# Altium project chinook_pcb_rotor.PrjPcb (part 2 of 2)

## Sheet led.SchDoc
size A4; SheetNumber: 9; SheetTotal: 12
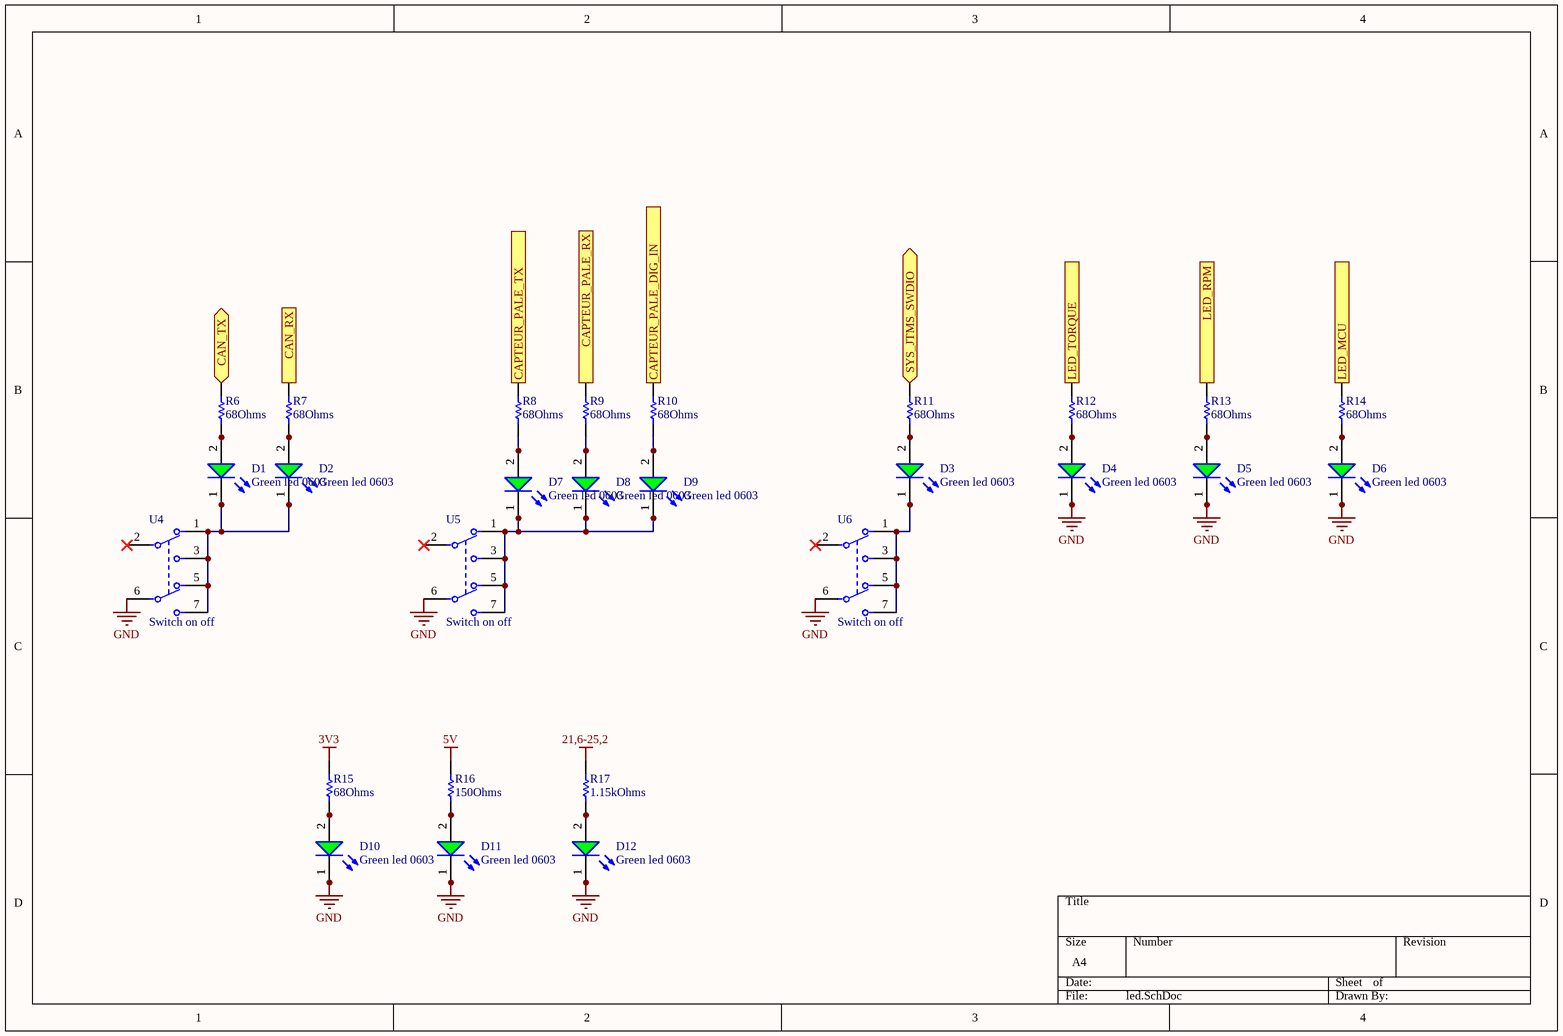
[diagram p8: led.SchDoc]

### Parts
(Parts that share a designator on the sheet are numbered #1, #2 ... from top to bottom, then left to right.)
D1#1  Green led 0603  [WL-SMCW_0603_150060xx75000]
D2  Green led 0603  [WL-SMCW_0603_150060xx75000]
D3  Green led 0603  [WL-SMCW_0603_150060xx75000]
D4  Green led 0603  [WL-SMCW_0603_150060xx75000]
D5  Green led 0603  [WL-SMCW_0603_150060xx75000]
D6  Green led 0603  [WL-SMCW_0603_150060xx75000]
D7  Green led 0603  [WL-SMCW_0603_150060xx75000]
D8  Green led 0603  [WL-SMCW_0603_150060xx75000]
D9  Green led 0603  [WL-SMCW_0603_150060xx75000]
D10  Green led 0603  [WL-SMCW_0603_150060xx75000]
D11  Green led 0603  [WL-SMCW_0603_150060xx75000]
D12  Green led 0603  [WL-SMCW_0603_150060xx75000]
R6#1  68Ohms  [RESC1005X40X25LL05T10]
R7#1  68Ohms  [RESC1005X40X25LL05T10]
R8#1  68Ohms  [RESC1005X40X25LL05T10]
R9#1  68Ohms  [RESC1005X40X25LL05T10]
R10#1  68Ohms  [RESC1005X40X25LL05T10]
R11#1  68Ohms  [RESC1005X40X25LL05T10]
R12#1  68Ohms  [RESC1005X40X25LL05T10]
R13  68Ohms  [RESC1005X40X25LL05T10]
R14  68Ohms  [RESC1005X40X25LL05T10]
R15  68Ohms  [RESC1005X40X25LL05T10]
R16  150Ohms  [RESC1005X40X25LL05T10]
R17  1.15kOhms  [RESC1005X40X25NL05T10]
U4#1  Switch on off  [FP-JS202011JCQN-MFG]
U5#1  Switch on off  [FP-JS202011JCQN-MFG]
U6#2  Switch on off  [FP-JS202011JCQN-MFG]

### Ports
CAN_RX, CAN_TX (bidir), CAPTEUR_PALE_DIG_IN (out), CAPTEUR_PALE_RX, CAPTEUR_PALE_TX (out), LED_MCU (out), LED_RPM (out), LED_TORQUE (out), SYS_JTMS_SWDIO (bidir)

### Nets
3V3: R15.2
5V: R16.2
21,6-25,2: R17.2
GND: D4.1(K) D5.1(K) D6.1(K) D10.1(K) D11.1(K) D12.1(K) U4#1.6(2_C) U5#1.6(2_C) U6#2.6(2_C)
SYS_JTMS_SWDIO: R11#1.2 ; port SYS_JTMS_SWDIO
NetD1#1_1: D1#1.1(K) D2.1(K) U4#1.1 U4#1.3 U4#1.5 U4#1.7
NetD1#1_2: D1#1.2(A) R6#1.1
NetD2_2: D2.2(A) R7#1.1
NetD3_1: D3.1(K) U6#2.1 U6#2.3 U6#2.5 U6#2.7
NetD3_2: D3.2(A) R11#1.1
NetD4_2: D4.2(A) R12#1.1
NetD5_2: D5.2(A) R13.1
NetD6_2: D6.2(A) R14.1
NetD7_1: D7.1(K) D8.1(K) D9.1(K) U5#1.1 U5#1.3 U5#1.5 U5#1.7
NetD7_2: D7.2(A) R8#1.1
NetD8_2: D8.2(A) R9#1.1
NetD9_2: D9.2(A) R10#1.1
NetD10_2: D10.2(A) R15.1
NetD11_2: D11.2(A) R16.1
NetD12_2: D12.2(A) R17.1
NetR6#1_2: R6#1.2 ; port CAN_TX
NetR7#1_2: R7#1.2 ; port CAN_RX
NetR8#1_2: R8#1.2 ; port CAPTEUR_PALE_TX
NetR9#1_2: R9#1.2 ; port CAPTEUR_PALE_RX
NetR10#1_2: R10#1.2 ; port CAPTEUR_PALE_DIG_IN
NetR12#1_2: R12#1.2 ; port LED_TORQUE
NetR13_2: R13.2 ; port LED_RPM
NetR14_2: R14.2 ; port LED_MCU

Not connected (* = marked no-connect by the designer): U4#1 2(1_C)*; U5#1 2(1_C)*; U6#2 2(1_C)*

### Library data of the parts
D1#1 D2-D12 = 150060VS75000: WURTH ELEKTRONIK - 150060VS75000 - LED, Green, SMD, 0603, 30 mA, 2 V, 570 nm; Manufacturer: Wurth Electronics; Lens Color: Colorless; Luminous Intensity: 40mcd; Viewing Angle: 140°; Forward Voltage: 2V; Lens Style: Rectangular,Flat; Forward Current: 20mA; Dominant Wavelength: 570nm; Lens Transparency: Clear; Power Rating: 72mW; Reverse Voltage (DC): 5V; Lens Size: 0.7mm; Supplier: Digikey; Supplier Part Number: 732-4980-1-ND; Manufacturer Part Number: 150060VS75000; RoHS: Yes; Category: LEDs; Stock: 75022; Pricing: 1=0.15, 50=0.142, 100=0.122, 500=0.105, 1000=0.10125 (USD); Mounting Technology: Surface Mount; Case/Package: 0603; Pins: 2; Color: Green; Case Code (Metric): 1608; Case Code (Imperial): 0603; Weight: 0.000882oz; Min Operating Temperature: -40°C; Max Operating Temperature: 85°C; Package Quantity: 4000; Packaging: Cut Tape; Test Current: 20mA; Illumination Color: Green; Series: WL-SMCW; Max Reverse Voltage (DC): 5V; Power Dissipation: 72mW; Reverse Voltage: 5V; Length: 1.6mm; Width: 0.8mm; Height: 0.8mm; RoHS Compliant: Yes; Reach SVHC Compliant: 4187SVHC; ComponentLink1URL: https://datasheet.ciiva.com/29562/150060vs75000-29562919.pdf?src-supplier=Digikey; ComponentLink1Description: https://datasheet.ciiva.com/29562/150060vs75000-29562919.pdf?src-supplier=Digikey
R6#1 R7#1 R8#1 R9#1 R10#1 R11#1 R12#1 R13-R15 = RC0402FR-0768RL: SMD Chip Resistor, 68 Ohm, ± 1%, 63 mW, 0402 [1005 Metric], Thick Film, General Purpose; Manufacturer: Yageo; Value: 68R; Power Rating: 63mW; Voltage Rating: 50V; Temperature Coefficient: 100ppm/°C; Supplier: Digikey; Supplier Part Number: 311-68.0LRCT-ND; Manufacturer Part Number: RC0402FR-0768RL; RoHS: Yes; Category: Chip SMD Resistors; Stock: 982905; Pricing: 1=0.1, 10=0.015, 50=0.0088, 100=0.0073, 500=0.00488, 1000=0.00417, 5000=0.00297 (USD); Case/Package: 0402; Case Code (Metric): 1005; Case Code (Imperial): 0402; Min Operating Temperature: -55°C; Max Operating Temperature: 155°C; Tolerance: 1%; Package Quantity: 1; Packaging: Tape and Reel; Resistor Type: Thick Film; Number of Terminations: 2; Termination: SMD/SMT; Max Power Dissipation: 63mW; Features: Moisture Resistant; Series: RC; Resistance Tolerance: 1%; Construction: Rectangular; Voltage Rating (AC): 50V; Length: 0.039inch; Width: 0.02inch; Height: 0.016inch; Depth: 0.5mm; Reach SVHC Compliant: No; Military Standard: Not; Lead Free: Lead Free; RoHS Compliant: Yes; ComponentLink1URL: https://datasheet.ciiva.com/2453/pyu-r-int-thick-7-2453524.pdf?src-supplier=Digikey; ComponentLink1Description: https://datasheet.ciiva.com/2453/pyu-r-int-thick-7-2453524.pdf?src-supplier=Digikey; ComponentLink2URL: https://datasheet.ciiva.com/2453/pyu-r-int-thick-7-2453525.pdf?src-supplier=Digikey; ComponentLink2Description: https://datasheet.ciiva.com/2453/pyu-r-int-thick-7-2453525.pdf?src-supplier=Digikey; ComponentLink3URL: https://datasheet.ciiva.com/2453/pyu-r-int-thick-7-2453523.pdf?src-supplier=Digikey; ComponentLink3Description: https://datasheet.ciiva.com/2453/pyu-r-int-thick-7-2453523.pdf?src-supplier=Digikey; ComponentLink4URL: https://datasheet.ciiva.com/5558/pyu-rc0402-51-rohs-l-6-r-5558023.pdf?src-supplier=Mouser; ComponentLink4Description: https://datasheet.ciiva.com/5558/pyu-rc0402-51-rohs-l-6-r-5558023.pdf?src-supplier=Mouser; ComponentLink5URL: https://datasheet.ciiva.com/7850/1018594-7850074.pdf?src-supplier=Element14; ComponentLink5Description: https://datasheet.ciiva.com/7850/1018594-7850074.pdf?src-supplier=Element14; ComponentLink6URL: https://datasheet.ciiva.com/7850/1018594-7850075.pdf?src-supplier=Element14; ComponentLink6Description: https://datasheet.ciiva.com/7850/1018594-7850075.pdf?src-supplier=Element14; ComponentLink7URL: https://datasheet.ciiva.com/15189/getdatasheetpartid-325392-15189501.pdf?src-supplier=Verical; ComponentLink7Description: https://datasheet.ciiva.com/15189/getdatasheetpartid-325392-15189501.pdf?src-supplier=Verical
R16 = RC0402FR-07150RL: SMD Chip Resistor, 150 Ohm, ± 1%, 63 mW, 0402 [1005 Metric], Thick Film, General Purpose; Manufacturer: Yageo; Value: 150R; Power Rating: 63mW; Voltage Rating: 50V; Temperature Coefficient: 100ppm/°C; Supplier: Digikey; Supplier Part Number: 311-150LRCT-ND; Manufacturer Part Number: RC0402FR-07150RL; RoHS: Yes; Category: Chip SMD Resistors; Stock: 5570890; Pricing: 1=0.1, 10=0.015, 50=0.0088, 100=0.0073, 500=0.00488, 1000=0.00417, 5000=0.00297 (USD); Case/Package: 0402; Case Code (Metric): 1005; Case Code (Imperial): 0402; Min Operating Temperature: -55°C; Max Operating Temperature: 155°C; Tolerance: 1%; Packaging: Tape and Reel; Package Quantity: 1; Resistor Type: Thick Film; Number of Terminations: 2; Termination: SMD/SMT; Max Power Dissipation: 63mW; Working Voltage: 50V; Features: Moisture Resistant; Series: RC; Resistance Tolerance: 1%; Construction: Rectangular; Technology: THICK FILM; Voltage Rating (AC): 50V; Length: 0.039inch; Width: 0.02inch; Height: 0.016inch; Depth: 0.5mm; Military Standard: Not; Lead Free: Lead Free; RoHS Compliant: Yes; Reach SVHC Compliant: Unknown; ComponentLink1URL: https://datasheet.ciiva.com/11808/0900766b80c66297-11808422.pdf?src-supplier=Rs; ComponentLink1Description: https://datasheet.ciiva.com/11808/0900766b80c66297-11808422.pdf?src-supplier=Rs; ComponentLink2URL: https://datasheet.ciiva.com/5558/pyu-rc0402-51-rohs-l-6-r-5558110.pdf?src-supplier=Mouser; ComponentLink2Description: https://datasheet.ciiva.com/5558/pyu-rc0402-51-rohs-l-6-r-5558110.pdf?src-supplier=Mouser
R17 = RC0402FR-071K15L: SMD Chip Resistor, 1.15 kOhm, ± 1%, 63 mW, 0402 [1005 Metric], Thick Film, General Purpose; Manufacturer: Yageo; Value: 1.15kR; Temperature Coefficient: 100ppm/°C; Power Rating: 62.5mW; Voltage Rating: 50V; Max Power Dissipation: 63mW; Supplier: Digikey; Supplier Part Number: YAG3033CT-ND; Manufacturer Part Number: RC0402FR-071K15L; RoHS: Yes; Category: Chip SMD Resistors; Stock: 290462; Pricing: 1=0.1, 10=0.015, 50=0.0088, 100=0.0073, 500=0.00488, 1000=0.00417, 5000=0.00297 (USD); Case/Package: 0402; Contact Plating: Tin,Lead; Case Code (Imperial): 0402; Case Code (Metric): 1005; Min Operating Temperature: -55°C; Max Operating Temperature: 155°C; Tolerance: 1%; Packaging: Tape and Reel; Number of Terminations: 2; Termination: SMD/SMT; Voltage Rating (DC): 50V; Features: Moisture Resistant; Series: RC; Construction: Rectangular; Length: 1mm; Width: 0.5mm; Height: 0.016inch; Depth: 0.5mm; Military Standard: Not; Lead Free: Lead Free; RoHS Compliant: Yes; ComponentLink1URL: https://datasheet.ciiva.com/8895/pyu-rc0402-51-rohs-l-6-8895884.pdf?src-supplier=Avnet; ComponentLink1Description: https://datasheet.ciiva.com/8895/pyu-rc0402-51-rohs-l-6-8895884.pdf?src-supplier=Avnet; ComponentLink2URL: https://datasheet.ciiva.com/26829/getdatasheetpartid-326427-26829948.pdf?src-supplier=Verical; ComponentLink2Description: https://datasheet.ciiva.com/26829/getdatasheetpartid-326427-26829948.pdf?src-supplier=Verical
U4#1 U5#1 U6#2 = JS202011JCQN: SWITCH SLIDE DPDT 300mA 6V; Manufacturer: ITT C&K; Actuator Material: Nylon,Polyamide,PA46; Switch Function: On-On; Actuator Type: Standard; Switch Travel: 2mm; Electrical Life: 5000Cycles; Supplier: Digikey; Supplier Part Number: CKN10723CT-ND; Manufacturer Part Number: JS202011JCQN; RoHS: No; Category: Slide Switches; Stock: 20641; Pricing: 1=0.8, 10=0.769, 25=0.74, 100=0.6422, 250=0.58596, 500=0.54452 (USD); Mounting Technology: Surface Mount; Contact Material: Copper Alloy; Contact Plating: Silver; Min Operating Temperature: -40°C; Max Operating Temperature: 85°C; Throw Configuration: DPDT; Packaging: Cut Tape; Voltage Rating (DC): 6V; Series: JS; Actuator Length: 2mm; ComponentLink1URL: http://www.farnell.com/datasheets/2674788.pdf?src-supplier=Farnell; ComponentLink1Description: http://www.farnell.com/datasheets/2674788.pdf?src-supplier=Farnell; ComponentLink2URL: http://www.farnell.com/datasheets/2674788.pdf?src-supplier=Element14; ComponentLink2Description: http://www.farnell.com/datasheets/2674788.pdf?src-supplier=Element14; ComponentLink3URL: https://datasheet.octopart.com/JS202011JCQN-C%26K-Components-datasheet-67873653.pdf?src-supplier=Newark; ComponentLink3Description: https://datasheet.octopart.com/JS202011JCQN-C%26K-Components-datasheet-67873653.pdf?src-supplier=Newark; ComponentLink4URL: http://www.farnell.com/datasheets/2674788.pdf?src-supplier=Newark; ComponentLink4Description: http://www.farnell.com/datasheets/2674788.pdf?src-supplier=Newark; ComponentLink5URL: https://www.ckswitches.com/media/1422/js.pdf?src-supplier=Digikey; ComponentLink5Description: https://www.ckswitches.com/media/1422/js.pdf?src-supplier=Digikey; ComponentLink6URL: https://datasheet.octopart.com/JS202011JCQN-C%26K-Components-datasheet-138126065.pdf?src-supplier=TME; ComponentLink6Description: https://datasheet.octopart.com/JS202011JCQN-C%26K-Components-datasheet-138126065.pdf?src-supplier=TME

## Sheet alimentation.SchDoc
size A4; SheetNumber: 10; SheetTotal: 11
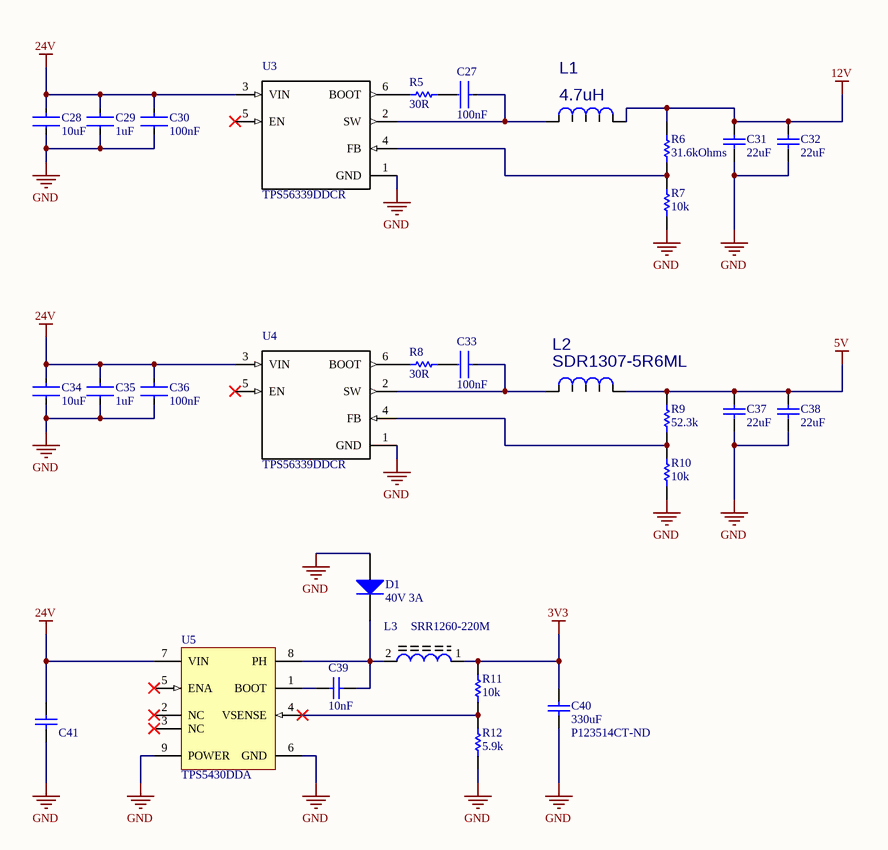
[diagram p9: alimentation.SchDoc]

### Parts
(Parts that share a designator on the sheet are numbered #1, #2 ... from top to bottom, then left to right.)
C27  100nF  [FP-GRM155-0_15-MFG]
C28  10uF  [FP-GRM155-0_15-MFG]
C29  1uF  [FP-GRM155-0_15-MFG]
C30  100nF  [FP-GRM155-0_15-MFG]
C31  22uF  [CAPC0805(2012)145_M]
C32  22uF  [CAPC0805(2012)145_M]
C33  100nF  [FP-GRM155-0_15-MFG]
C34  10uF  [FP-GRM155-0_15-MFG]
C35  1uF  [FP-GRM155-0_15-MFG]
C36  100nF  [FP-GRM155-0_15-MFG]
C37  22uF  [CAPC0805(2012)145_M]
C38  22uF  [CAPC0805(2012)145_M]
C39  10nF  [CAPC2013X70X50ML10T25]
C40  330uF  Supplier Part Number 1: P123514CT-ND  [CAP_TPE_D3L]
C41  CAP 10uF 50V 1206(3216)  [CS-1206]  (value not drawn)
D1#2  40V 3A  [DIODE_SCHOTTKY_SMB]
L1  4.7uH  [IHLP2525EZER4R7M01]
L2  SDR1307-5R6ML  [IND_BOURNS_SDR13]
L3  SRR1260-220M  [*INDP125125X600N]
R5  30R  [RESC0805(2012)_N]
R6#2  31.6kOhms  [CS-1206]
R7#2  10k  [RESC1206(3216)_L]
R8#2  30R  [RESC0805(2012)_N]
R9#2  52.3k  [RESC1609X50X30LL10T20]
R10#2  10k  [RESC1206(3216)_L]
R11#2  10k  [RESC1206(3216)_L]
R12#2  5.9k  [RESC1005X40X25LL05T05]
U3#2  TPS56339DDCR  [*SOT95P280X110-6N]
U4#2  TPS56339DDCR  [*SOT95P280X110-6N]
U5#2  TPS5430DDA  [DDA0008J_M]

### Nets
3V3: C40.2 L3.1 R11#2.2
5V: C37.2 C38.2 L2.1 R9#2.2
12V: C31.2 C32.2 L1.1 R6#2.2
24V: C28.1 C29.1 C30.1 C34.1 C35.1 C36.1 C41.2 U3#2.3(VIN) U4#2.3(VIN) U5#2.7(VIN)
GND: C28.2 C29.2 C30.2 C31.1 C32.1 C34.2 C35.2 C36.2 C37.1 C38.1 C40.1 C41.1 D1#2.1(A) R7#2.1 R10#2.1 R12#2.1 U3#2.1(GND) U4#2.1(GND) U5#2.6(GND) U5#2.9(POWER)
NetC27_1: C27.1 L1.2 U3#2.2(SW)
NetC27_2: C27.2 R5.2
NetC33_1: C33.1 L2.2 U4#2.2(SW)
NetC33_2: C33.2 R8#2.2
NetC39_1: C39.1 U5#2.1(BOOT)
NetC39_2: C39.2 D1#2.2(K) L3.2 U5#2.8(PH)
NetR5_1: R5.1 U3#2.6(BOOT)
NetR6#2_1: R6#2.1 R7#2.2 U3#2.4(FB)
NetR8#2_1: R8#2.1 U4#2.6(BOOT)
NetR9#2_1: R9#2.1 R10#2.2 U4#2.4(FB)
NetR11#2_1: R11#2.1 R12#2.2 U5#2.4(VSENSE)

Not connected (* = marked no-connect by the designer): U3#2 5(EN)*; U4#2 5(EN)*; U5#2 2(NC)* 3(NC)* 5(ENA)*

### Library data of the parts
C27 C30 C33 C36 = CL05A104KA5NNNC: Multilayer Ceramic Capacitor, 0.1 uF, 25 V, ± 10%, X5R, 0402 [1005 Metric]; Manufacturer: Samsung; Material: 4241ConductorMaterial; Voltage Rating: 25V; Supplier: Digikey; Supplier Part Number: 1276-1043-1-ND; Manufacturer Part Number: CL05A104KA5NNNC; RoHS: Yes; Category: Ceramic Capacitors; Stock: 11930039; Pricing: 1=0.1, 10=0.01, 50=0.0054, 100=0.0042, 500=0.00318, 1000=0.0025, 2500=0.00227, 5000=0.00209 (USD); Mounting Technology: Surface Mount; Case/Package: 0402; Case Code (Metric): 1005; Case Code (Imperial): 0402; Min Operating Temperature: -55°C; Max Operating Temperature: 85°C; Value: 100nF; Packaging: Tape and Reel; Tolerance: 10%; Dielectric: X5R; Voltage: 25V; Series: CL; Construction: Flat; Package Quantity: 1; Voltage Rating (DC): 25V; Length: 1mm; Width: 0.02inch; Height: 0.5mm; Depth: 0.5mm; Thickness: 0.022inch; Radiation Hardening: No; RoHS Compliant: Yes; Lead Free: Lead Free; ComponentLink1URL: https://datasheet.ciiva.com/25802/cl05a104ka5nnnc-25802704.pdf?src-supplier=Digikey; ComponentLink1Description: https://datasheet.ciiva.com/25802/cl05a104ka5nnnc-25802704.pdf?src-supplier=Digikey; ComponentLink2URL: https://datasheet.ciiva.com/16437/cl05a104ka5nnnc-16437369.pdf?src-supplier=Future+Electronics; ComponentLink2Description: https://datasheet.ciiva.com/16437/cl05a104ka5nnnc-16437369.pdf?src-supplier=Future+Electronics; ComponentLink3URL: https://datasheet.ciiva.com/26838/getdatasheetpartid-357412-26838142.pdf?src-supplier=Verical; ComponentLink3Description: https://datasheet.ciiva.com/26838/getdatasheetpartid-357412-26838142.pdf?src-supplier=Verical; ComponentLink4URL: https://datasheet.ciiva.com/26309/mlcc-catalogdownload2013-eng-26309014.pdf?src-supplier=Distrelec; ComponentLink4Description: https://datasheet.ciiva.com/26309/mlcc-catalogdownload2013-eng-26309014.pdf?src-supplier=Distrelec
C28 C34 = GRM155R60J106ME15D: Multilayer Ceramic Capacitor, 10 uF, 6.3 V, ± 20%, X5R, 0402 [1005 Metric]; Manufacturer: Murata; Material: 4241ConductorMaterial; Voltage Rating: 6.3V; Supplier: Digikey; Supplier Part Number: 490-13238-1-ND; Manufacturer Part Number: GRM155R60J106ME15D; RoHS: Yes; Category: Ceramic Capacitors; Stock: 6215687; Pricing: 1=0.17, 10=0.11, 50=0.0696, 100=0.0557, 500=0.04022, 1000=0.03558, 2500=0.03404, 5000=0.03094 (USD); Mounting Technology: Surface Mount; Case/Package: 0402; Case Code (Metric): 1005; Case Code (Imperial): 0402; Min Operating Temperature: -55°C; Max Operating Temperature: 85°C; Packaging: Cut Tape; Value: 10uF; Tolerance: 20%; Voltage Rating (DC): 6.3V; Dielectric: X5R; Series: GRM; Length: 0.039inch; Width: 0.02inch; Height: 650um; Thickness: 0.026inch; RoHS Compliant: Yes; ComponentLink1URL: https://datasheet.octopart.com/GRM155R60J106ME15D-Murata-datasheet-149522992.pdf?src-supplier=Newark; ComponentLink1Description: https://datasheet.octopart.com/GRM155R60J106ME15D-Murata-datasheet-149522992.pdf?src-supplier=Newark; ComponentLink2URL: https://www.murata.com/~/media/webrenewal/support/library/catalog/products/capacitor/mlcc/c02e.ashx?la=en-us&src-supplier=Digikey; ComponentLink2Description: https://www.murata.com/~/media/webrenewal/support/library/catalog/products/capacitor/mlcc/c02e.ashx?la=en-us&src-supplier=Digikey; ComponentLink3URL: https://datasheet.octopart.com/GRM155R60J106ME15D-Murata-datasheet-165579666.pdf?src-supplier=TME; ComponentLink3Description: https://datasheet.octopart.com/GRM155R60J106ME15D-Murata-datasheet-165579666.pdf?src-supplier=TME
C29 C35 = GRM155R61E105MA12D: Multilayer Ceramic Capacitor, 1 uF, 25 V, ± 20%, X5R, 0402 [1005 Metric]; Manufacturer: Murata; Voltage Rating: 25V; Supplier: Digikey; Supplier Part Number: 490-10018-1-ND; Manufacturer Part Number: GRM155R61E105MA12D; RoHS: Yes; Category: Ceramic Capacitors; Stock: 2496490; Pricing: 1=0.1, 10=0.066, 50=0.0376, 100=0.0292, 500=0.022, 1000=0.01728, 2500=0.01571, 5000=0.01445 (USD); Mounting Technology: Surface Mount; Case/Package: 0402; Case Code (Metric): 1005; Case Code (Imperial): 0402; Weight: 0.000212oz; Min Operating Temperature: -55°C; Max Operating Temperature: 85°C; Value: 1uF; Packaging: Tape and Reel; Tolerance: 20%; Dielectric: X5R; Termination: SMD/SMT; Voltage Rating (DC): 25V; Package Quantity: 10000; Series: GRM; Length: 0.039inch; Width: 0.02inch; Height: 0.5mm; Thickness: 0.022inch; RoHS Compliant: Yes; ComponentLink1URL: http://www.mouser.com/ds/2/281/c02e-2905.pdf?src-supplier=Mouser; ComponentLink1Description: http://www.mouser.com/ds/2/281/c02e-2905.pdf?src-supplier=Mouser; ComponentLink2URL: https://datasheet.octopart.com/GRM155R61E105MA12D-Murata-datasheet-149523023.pdf?src-supplier=Newark; ComponentLink2Description: https://datasheet.octopart.com/GRM155R61E105MA12D-Murata-datasheet-149523023.pdf?src-supplier=Newark; ComponentLink3URL: https://datasheet.octopart.com/GRM155R61E105MA12D-Murata-datasheet-22122223.pdf?src-supplier=Future+Electronics; ComponentLink3Description: https://datasheet.octopart.com/GRM155R61E105MA12D-Murata-datasheet-22122223.pdf?src-supplier=Future+Electronics; ComponentLink4URL: http://search.murata.co.jp/Ceramy/image/img/A01X/G101/ENG/GRM155R61E105MA12-01.pdf?src-supplier=Digikey; ComponentLink4Description: http://search.murata.co.jp/Ceramy/image/img/A01X/G101/ENG/GRM155R61E105MA12-01.pdf?src-supplier=Digikey
C31 C32 C37 C38 = CMP-1036-04945-1: CAP 22uF 16V ±10% 0805 (2012 Metric) Thickness 1.45mm SMD; Case-EIA: 0805; Tolerance: Â±10%; Case-Metric: 2012; Technology: SMT; Max Thickness: 1.45 mm; Rated Voltage: 16 V; Value: 22uF
C39 = CMP-2000-05000-1: CAP, Ceramic, 10 nF, +/- 10%, 50 V, -55 to 125 degC, 0805 (2012 Metric), RoHS, Tape and Reel; Manufacturer: Yageo; Other Names: 311-1136-6; Capacitance: 10000pF; Temperature Coefficient: X7R; Catalog Drawings: CC_0805_0.6; Featured Product: CommodityMultilayerCeramicCapacitors–CCSeries; Online Catalog: CCSeries; Product Training Modules: MultilayerCeramicCapacitors; Voltage - Rated: 50V; Packaging: Digi-Reel; Height - Seated (Max): -; Tolerance: ±10%; Applications: GeneralPurpose; Features: -; Datasheet Version: Rev. 2, 05/2009; Mounting Type: SurfaceMount,MLCC; Ratings: -; Lead Style: -; Manufacturer URL: http://www.yageo.com/; Package / Case: 0805(2012Metric); Operating Temperature: -55degC~125degC; Standard Package: 1; Package Description: 2-Pin Surface Mount Device, Body 2 x 1.25 mm; Datasheet URL: https://datasheet.ciiva.com/11786/0900766b80d84f1d-11786119.pdf; Lead Spacing: -; Series: CC; Category: Capacitors; Family: CeramicCapacitors; Package Reference: 0805 (2012 Metric)
C40 = 6TPE330MAL: Cap Tant Polymer 330uF 6.3VDC D3L CASE 20% (7.3 X 4.3 X 2.8mm) SMD 7343 0.025 Ohm 105C Embossed T/R; Manufacturer 1: Panasonic; Voltage Rating: 6.3V; ESR (Equivalent Series Resistance): 25mR; Ripple Current: 2.4A; Leakage Current: 207.9uA; Polarity: Polar; Dissipation Factor: 10%; Supplier 1: Digi-Key; Manufacturer Part Number 1: 6TPE330MAL; Stock 1: 2448; Pricing 1: 1=1.54000, 10=1.21400, 100=0.91080, 500=0.68816, 1000=0.60720 (USD); RoHS: Yes; Mount: Surface Mount; Case/Package: 2917; Case Code (Metric): 7343; Case Code (Imperial): 2917; Min Operating Temperature: -55°C; Max Operating Temperature: 105°C; Package Quantity: 2500; Packaging: Tape and Reel; Capacitance: 330uF; Tolerance: 20%; Voltage Rating (DC): 6.3V; Termination: SMD/SMT; Voltage: 6.3V; Features: General Purpose; Length: 7.3mm; Height: 2.8mm; Width: 0.169inch; Height - Seated (Max): 0.118inch; Depth: 4.3mm; Radiation Hardening: No; REACH SVHC: No SVHC; Lead Free: Lead Free; ComponentLink1URL: https://datasheet.ciiva.com/22745/1734363-22745356.pdf?src-supplier=Element14; ComponentLink1Description: https://datasheet.ciiva.com/22745/1734363-22745356.pdf?src-supplier=Element14; ComponentLink2URL: https://datasheet.ciiva.com/25785/1734363-25785996.pdf?src-supplier=Farnell; ComponentLink2Description: https://datasheet.ciiva.com/25785/1734363-25785996.pdf?src-supplier=Farnell
C41 = CMP-1037-04982-1: CAP 10uF 50V ±10% 1206 (3216 Metric) Thickness 1.9mm SMD; Manufacturer: TDK; Manufacturer Part Number: C3216X5R1H106K; Case-EIA: 1206; Tolerance: Â±10%; Case-Metric: 3216; Technology: SMT; Max Thickness: 1.9 mm; Value: 10uF; Rated Voltage: 50 V
D1#2 = B340B-13-F: DIODE SCHOTTKY 40V 3A SMB; Manufacturer 1: Diodes; Element Configuration: Single; Peak Reverse Current: 500uA; Forward Voltage: 500mV; Peak Non-Repetitive Surge Current: 100A; Polarity: Standard; Capacitance: 250pF; Supplier 1: Digi-Key; Manufacturer Part Number 1: B340B-13-F; Stock 1: 44365; Pricing 1: 1=0.48000, 10=0.39100, 100=0.26620, 500=0.19968, 1000=0.14976 (USD); RoHS: Yes; Mount: Surface Mount; Case/Package: SMB; Number of Pins: 2; Weight: 0.00328oz; Min Operating Temperature: -55°C; Max Operating Temperature: 150°C; Forward Current: 3A; Max Repetitive Reverse Voltage (Vrrm): 40V; Packaging: Tape and Reel; Max Forward Surge Current (Ifsm): 100A; Package Quantity: 3000; Average Rectified Current: 3A; Termination: SMD/SMT; Voltage Rating (DC): 40V; Current Rating: 3A; Output Current: 3A; Max Reverse Voltage (DC): 40V; Length: 4.57mm; Height: 2.5mm; Width: 3.94mm; Radiation Hardening: No; REACH SVHC: No SVHC; Lead Free: Lead Free; ComponentLink1URL: https://datasheet.ciiva.com/26949/getdatasheetpartid-110980-26949353.pdf?src-supplier=Verical; ComponentLink1Description: https://datasheet.ciiva.com/26949/getdatasheetpartid-110980-26949353.pdf?src-supplier=Verical; ComponentLink2URL: https://datasheet.ciiva.com/25946/ds30924-25946951.pdf?src-supplier=Avnet+Europe; ComponentLink2Description: https://datasheet.ciiva.com/25946/ds30924-25946951.pdf?src-supplier=Avnet+Europe; ComponentLink3URL: https://datasheet.ciiva.com/16203/ds30924-16203765.pdf?src-supplier=Future+Electronics; ComponentLink3Description: https://datasheet.ciiva.com/16203/ds30924-16203765.pdf?src-supplier=Future+Electronics; Supplier Part Number 1: B340B-FDICT-ND
L1 = IHLP2525EZER4R7M01: FIXED IND 4.7UH 6.5A 30.3MOHM SM; Manufacturer_Part_Number: SDR1307-5R6ML; C: Copyright (C) 2015 Accelerated Designs. All rights reserved; Vendor: Bourns Electronics; Built_By: EMA_UL_Team; Supplier 1: Mouser; Supplier Part Number 1: 70-IHLP2525EZER4R7M0
L2 = SDR1307-5R6ML: C: Copyright (C) 2015 Accelerated Designs. All rights reserved; Vendor: Bourns Electronics; Built_By: EMA_UL_Team; Manufacturer_Part_Number: SDR1307-5R6ML; Value: SDR1307-5R6ML
L3 = SRR1260-220M: 22ÂµH Shielded Wirewound Inductor 4A 43mOhm Max Nonstandard; MF: Bourns; Digi-Key_Part_Number: SRR1260-220MCT-ND; Package: Nonstandard Bourns; SnapEDA_Link: https://www.snapeda.com/parts/SRR1260-220M/Bourns/view-part/290442/?ref=snap; Digi-Key_Purchase_URL: https://www.digikey.com/product-detail/en/bourns-inc/SRR1260-220M/SRR1260-220MCT-ND/2127411?utm_source=snapeda&utm_medium=aggregator&utm_campaign=symbol; MP: SRR1260-220M; Value: *
R5 R8#2 = CMP-1013-00336-1: 30R 0.125W 1% 0805 (2012 Metric)  SMD; Case-Metric: 2012; Value: 30.00 Ohm; Case-EIA: 0805; Power: 0.125 W; Technology: SMT; Tolerance: 1 %
R6#2 = RC1206FR-0731K6L: RES 31.6K OHM 1% 1/4W 1206; Manufacturer: Yageo; Manufacturer Part Number: RC0402FR-0768RL; Value: 68R; Power Rating: 63mW; Voltage Rating: 50V; Temperature Coefficient: 100ppm/°C; Supplier: Digikey; Supplier Part Number: 311-68.0LRCT-ND; RoHS: Yes; Category: Chip SMD Resistors; Stock: 982905; Pricing: 1=0.1, 10=0.015, 50=0.0088, 100=0.0073, 500=0.00488, 1000=0.00417, 5000=0.00297 (USD); Case/Package: 0402; Case Code (Metric): 1005; Case Code (Imperial): 0402; Min Operating Temperature: -55°C; Max Operating Temperature: 155°C; Tolerance: 1%; Package Quantity: 1; Packaging: Tape and Reel; Resistor Type: Thick Film; Number of Terminations: 2; Termination: SMD/SMT; Max Power Dissipation: 63mW; Features: Moisture Resistant; Series: RC; Resistance Tolerance: 1%; Construction: Rectangular; Voltage Rating (AC): 50V; Length: 0.039inch; Width: 0.02inch; Height: 0.016inch; Depth: 0.5mm; Reach SVHC Compliant: No; Military Standard: Not; Lead Free: Lead Free; RoHS Compliant: Yes; ComponentLink1URL: https://datasheet.ciiva.com/2453/pyu-r-int-thick-7-2453524.pdf?src-supplier=Digikey; ComponentLink1Description: https://datasheet.ciiva.com/2453/pyu-r-int-thick-7-2453524.pdf?src-supplier=Digikey; ComponentLink2URL: https://datasheet.ciiva.com/2453/pyu-r-int-thick-7-2453525.pdf?src-supplier=Digikey; ComponentLink2Description: https://datasheet.ciiva.com/2453/pyu-r-int-thick-7-2453525.pdf?src-supplier=Digikey; ComponentLink3URL: https://datasheet.ciiva.com/2453/pyu-r-int-thick-7-2453523.pdf?src-supplier=Digikey; ComponentLink3Description: https://datasheet.ciiva.com/2453/pyu-r-int-thick-7-2453523.pdf?src-supplier=Digikey; ComponentLink4URL: https://datasheet.ciiva.com/5558/pyu-rc0402-51-rohs-l-6-r-5558023.pdf?src-supplier=Mouser; ComponentLink4Description: https://datasheet.ciiva.com/5558/pyu-rc0402-51-rohs-l-6-r-5558023.pdf?src-supplier=Mouser; ComponentLink5URL: https://datasheet.ciiva.com/7850/1018594-7850074.pdf?src-supplier=Element14; ComponentLink5Description: https://datasheet.ciiva.com/7850/1018594-7850074.pdf?src-supplier=Element14; ComponentLink6URL: https://datasheet.ciiva.com/7850/1018594-7850075.pdf?src-supplier=Element14; ComponentLink6Description: https://datasheet.ciiva.com/7850/1018594-7850075.pdf?src-supplier=Element14; ComponentLink7URL: https://datasheet.ciiva.com/15189/getdatasheetpartid-325392-15189501.pdf?src-supplier=Verical; ComponentLink7Description: https://datasheet.ciiva.com/15189/getdatasheetpartid-325392-15189501.pdf?src-supplier=Verical; Supplier 1: Future Electronics; Supplier Part Number 1: 1163037
R7#2 R10#2 R11#2 = CMP-1014-00623-1: 10K 0.25W 1% 1206 (3216 Metric)  SMD; Case-Metric: 3216; Value: 10000.00 Ohm; Case-EIA: 1206; Power: 0.25 W; Technology: SMT; Tolerance: 1 %
R9#2 = CMP-2000-03451-1: Part Number: CRCW060352K3FKEA; Manufacturer: Vishay Dale
R12#2 = CMP-2002-00126-1: CRCW04025K90FKED; Manufacturer: Vishay Dale; Part Number: CRCW04025K90FKED
U3#2 U4#2 = TPS56339DDCR: BSR-MCP; MF: Texas Instruments; SnapEDA_Link: https://www.snapeda.com/parts/TPS56339DDCR/Texas%20Instruments/view-part/4178121/?ref=snap; Package: SOT-23-6 Texas Instruments; Availability: Unavailable; Price: None; MP: TPS56339DDCR; Value: *
U5#2 = CMP-2000-04960-1: Wide Input Range, Step-Down Converter, 5.5 to 36 V, -40 to 125 degC, 8-Pin SOIC, Pb-Free, Tape and Reel; Manufacturer: Texas Instruments; Synchronous Rectifier: No; Product Training Modules: UnderstandingSWIFTStepDownDc/DcConverters; Frequency - Switching: 500kHz; Voltage - Output: 1.23V~31V; Number of Outputs: 1; Current - Output: 3A; Dynamic Catalog: Buck(Step-Down)IC; Other Names: 296-19447-5; For Use With: TPS5430EVM-173F-ND / -TPS5430EVM-173F / 296-19640-ND / -EVALUATIONMODULEFORTPS5430 / 296-19432-ND / -EVALUATIONMODFORTPS5430-136; Voltage - Input: 5.5V~36V; Package Version: 4202561/F, 12/2011; PWM Type: VoltageMode; Output Type: Adjustable; Reference Design Library: TPS5430EVM-136:5V@3AStepDown,5.5~24Vin / TPS5430EVM-173:5V@3A,10~35Vin; Featured Product: WEBENCHDesignCenter; Type: Step-Down(Buck); Operating Temperature: -40degC~125degC; Family: PMIC-VoltageRegulators-DCDCSwitchingRegulators; Category: IntegratedCircuits(ICs); Package URL: http://www.ti.com/lit/ml/mpds092e/mpds092e.pdf; Datasheet Version: Rev. G, 02/2015; Packaging: Tube; Package Reference: DDA8-2875X2025TP; Series: SWIFT™; Manufacturer URL: http://www.ti.com/; Standard Package: 75; Supplier Device Package: 8-SOPowerPad; Mounting Type: SurfaceMount; Package Description: 8-Pin Small Outline Package, Body 4.9 x 3.9 mm, Pitch 1.27 mm; Datasheet URL: http://www.ti.com/general/docs/lit/getliterature.tsp?genericPartNumber=TPS5430&fileType=pdf

## Sheet connecteur_principal.SchDoc
size A4; SheetNumber: 12; SheetTotal: 12
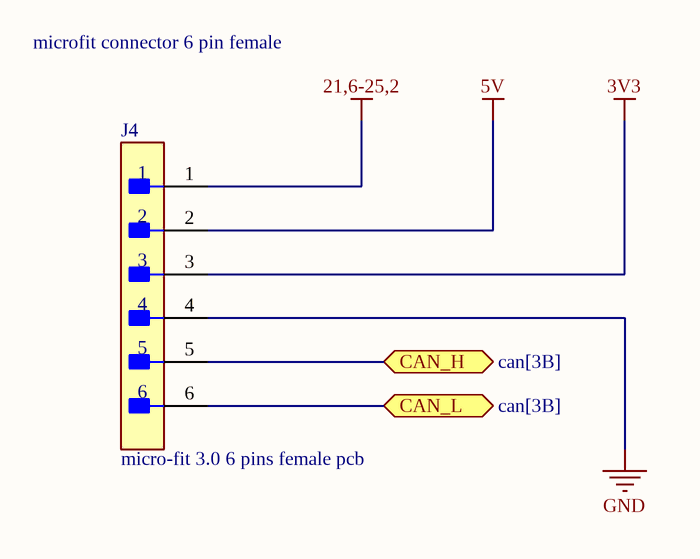
[diagram p10: connecteur_principal.SchDoc]

### Parts
J4  micro-fit 3.0 6 pins female pcb  [FP-0430450600-MFG]

### Ports
CAN_H (bidir, see can[3B]), CAN_L (bidir, see can[3B])

### Nets
3V3: J4.3
5V: J4.2
21,6-25,2: J4.1
GND: J4.4
NetJ4_5: J4.5 ; port CAN_H
NetJ4_6: J4.6 ; port CAN_L

### Notes on the sheet
- microfit connector 6 pin female

### Library data of the parts
J4 = 430450600: Connector Wire to Board Header 6 Position 3mm Solder Right Angle Thru-Hole Tray; Manufacturer: Molex; Manufacturer Part Number: 43045-0600; Plating: 154ConductorMaterial; Contact Resistance: 10mR; Voltage Rating: 250V; Current Rating: 5A; Max Voltage Rating (DC): 250.25kV; Gender: Male; Number of Positions: 6; Insulation Resistance: 1GR; Approvals: UL,CSA,TUV; Glow Wire Compliant: 15Compliance; Supplier: Digikey; Supplier Part Number: WM1815-ND; RoHS: Yes; Category: Headers and Wire Housings; Stock: 3053; Pricing: 1=2.2, 10=1.875, 80=1.54863, 1728=1.18185, 5184=1.08404 (USD); Mounting Technology: Through Hole; Case/Package: SMC; Contact Material: Brass,Tin; Contact Plating: Tin; Housing Color: Black; Housing Material: Thermoplastic; Color: Black; Material: 4301ConductorMaterial; Min Operating Temperature: -40°C; Max Operating Temperature: 105°C; Number of Rows: 2; Packaging: Tray; Termination: Solder; Orientation: Right Angle; Package Quantity: 1728; Max Current Rating: 5A; Number of Circuits: 6; Number of Contacts: 6; Series: 43045; Voltage Rating (DC): 250V; Diameter: 3mm; Length: 13.15mm; Height: 8.77mm; Pitch: 3mm; Depth: 12.2mm; Row Spacing: 3mm; Radiation Hardening: No; Flammability Rating: UL94 V-0; RoHS Compliant: Yes; Reach SVHC Compliant: Unknown; Halogen Free: 5696HalogenFree; Lead Free: 5697LeadFree; Parameter 1: *

## Nets that join several sheets
3V3: MCU (15 pins), can (C15.1 C16.1 U3#1.3), debug (R1.2 R2.2 R3.2), led (R15.2), alimentation (C40.2 L3.1 R11#2.2), connecteur_principal (J4.3)
5V: encodeur_pale (J7.1 U6#1.1), encodeur_rotor_rpm (J11.1), led (R16.2), alimentation (C37.2 C38.2 L2.1 R9#2.2), connecteur_principal (J4.2)
12V: encodeur_pale (J8.4), alimentation (C31.2 C32.2 L1.1 R6#2.2)
21,6-25,2: capteur_couple (J12.1), led (R17.2), connecteur_principal (J4.1)
GND: MCU (17 pins), capteur_couple (J12.4 R21.1), encodeur_pale (J7.6 J8.1 U6#1.4), encodeur_rotor_rpm (J11.4 R19.1), can (C15.2 C16.2 U3#1.2), debug (10 pins), led (9 pins), alimentation (20 pins), connecteur_principal (J4.4)
CAN_RX: MCU (U1.44), can (U3#1.4)
CAN_TX: MCU (U1.45), can (U3#1.1)
NetJ4_5: can (U3#1.7), connecteur_principal (J4.5)
NetJ4_6: can (U3#1.6), connecteur_principal (J4.6)
NetR14_2: MCU (U1.22), led (R14.2)
NetR18_1: MCU (U1.8), encodeur_rotor_rpm (R18.1 R19.2)
NetR20_1: MCU (U1.14), capteur_couple (R20.1 R21.2)
PB_1: MCU (U1.35), debug (5 pins)
PB_2: MCU (U1.36), debug (5 pins)
SYS_JTMS_SWDIO: debug (U2.1), led (R11#1.2)